# Altium schematic sheet TempMonADC.SchDoc
size A4; SheetNumber: 15; SheetTotal: 16
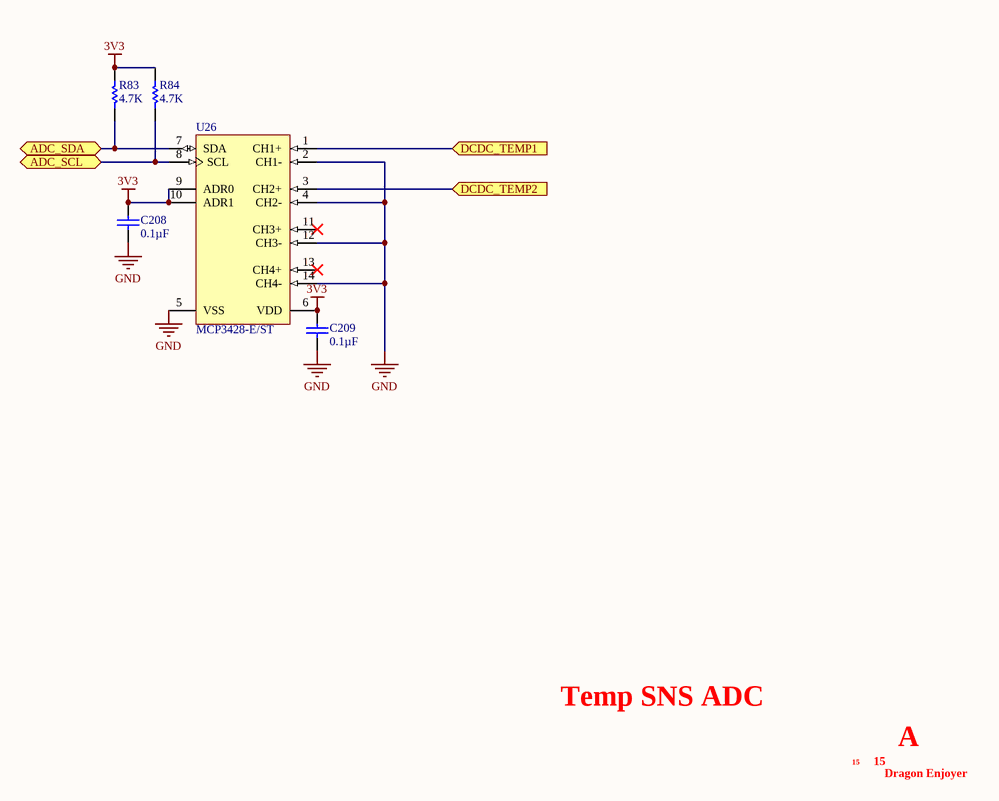
[diagram p0: TempMonADC.SchDoc]

## Parts
C208  Capacitance: 0.1µF  [CAPC1005X55X25LL05T05]  (hidden comment: CC0402ZRY5V8BB104)
C209  Capacitance: 0.1µF  [CAPC1005X55X25LL05T05]  (hidden comment: CC0402ZRY5V8BB104)
R83  value 4.7K  [RESC1005X40X25LL05T10]  (hidden comment: RC0402JR-074K7L)
R84  value 4.7K  [RESC1005X40X25LL05T10]  (hidden comment: RC0402JR-074K7L)
U26  MCP3428-E/ST  [TSSOP-ST14_L]

## Ports
ADC_SCL (bidir), ADC_SDA (bidir), DCDC_TEMP1 (in), DCDC_TEMP2 (in)

## Nets
3V3: C208.2 C209.2 R83.1 R84.1 U26.6(VDD) U26.9(ADR0) U26.10(ADR1)
GND: C208.1 C209.1 U26.2(CH1-) U26.4(CH2-) U26.5(VSS) U26.12(CH3-) U26.14(CH4-)
ADC_SCL: R84.2 U26.8(SCL) ; port ADC_SCL
ADC_SDA: R83.2 U26.7(SDA) ; port ADC_SDA
DCDC_TEMP1: U26.1(CH1+) ; port DCDC_TEMP1
DCDC_TEMP2: U26.3(CH2+) ; port DCDC_TEMP2

Not connected (* = marked no-connect by the designer): U26 11(CH3+)* 13(CH4+)*

## Notes on the sheet
- Temp SNS ADC
- 15
- A
- Dragon Enjoyer

## Library data of the parts
C208 C209 = CMP-2000-06071-1: Chip Capacitor, 100 nF, -20% to 80%, 25 V, -30 to 85 degC, 0402 (1005 Metric), RoHS, Tape and Reel; Manufacturer: Yageo; Online Catalog: CCSeries; Tolerance: -20%,+80%; Voltage - Rated: 25V; Product Training Modules: MultilayerCeramicCapacitors; Catalog Drawings: CC_0402; Other Names: 311-1375-6; Temperature Coefficient: Y5V(F); Datasheet URL: http://www.farnell.com/datasheets/1132289.pdf; Features: -; Package Description: 2-Pin Surface Mount Device, Body 1 x 0.5 mm; Standard Package: 1; Mounting Technology: SurfaceMount; Lead Style: -; Thickness (Max): 0.022"(0.55mm); Family: CeramicCapacitors; Series: CC; Applications: GeneralPurpose; Lead Spacing: -; Size / Dimension: 0.039"Lx0.020"W(1.00mmx0.50mm); Manufacturer URL: http://www.yageo.com/; Category: Capacitors; Datasheet Version: Rev. 5, 07/2010; Height - Seated (Max): -; Packaging: Digi-Reel®; Operating Temperature: -30°C~85°C; Mounting Type: SurfaceMount,MLCC; Package Reference: 0402; Ratings: -; Package / Case: 0402(1005Metric)
R83 R84 = CMP-2002-08011-1: Manufacturer: Yageo / Phycomp; Part Number: RC0402JR-074K7L
U26 = CMP-0188-01312-1: 16-Bit, Multi-Channel Delta-Sigma Analog-to-Digital Converter with I2C Interface and On-Board Reference, 14-Pin TSSOP, Extended Temperature; PackageVersion: revBB, Aug-2009; ComponentLink2URL: http://ww1.microchip.com/downloads/en/DeviceDoc/22226a.pdf; PackageReference: TSSOP-ST14; ComponentLink1Description: Manufacturer URL; PackageDescription: 14-Lead Plastic Thin Shrink Small Outline (ST) - 4.4mm Body [TSSOP]; ComponentLink1URL: http://www.microchip.com/; ComponentLink3Description: Package Specification; ComponentLink3URL: http://www.microchip.com/stellent/groups/techpub_sg/documents/packagingspec/en012702.pdf; DatasheetVersion: revA, Dec-2009; ComponentLink2Description: Datasheet